# Altium project ee_453_Schulz.PrjPcb
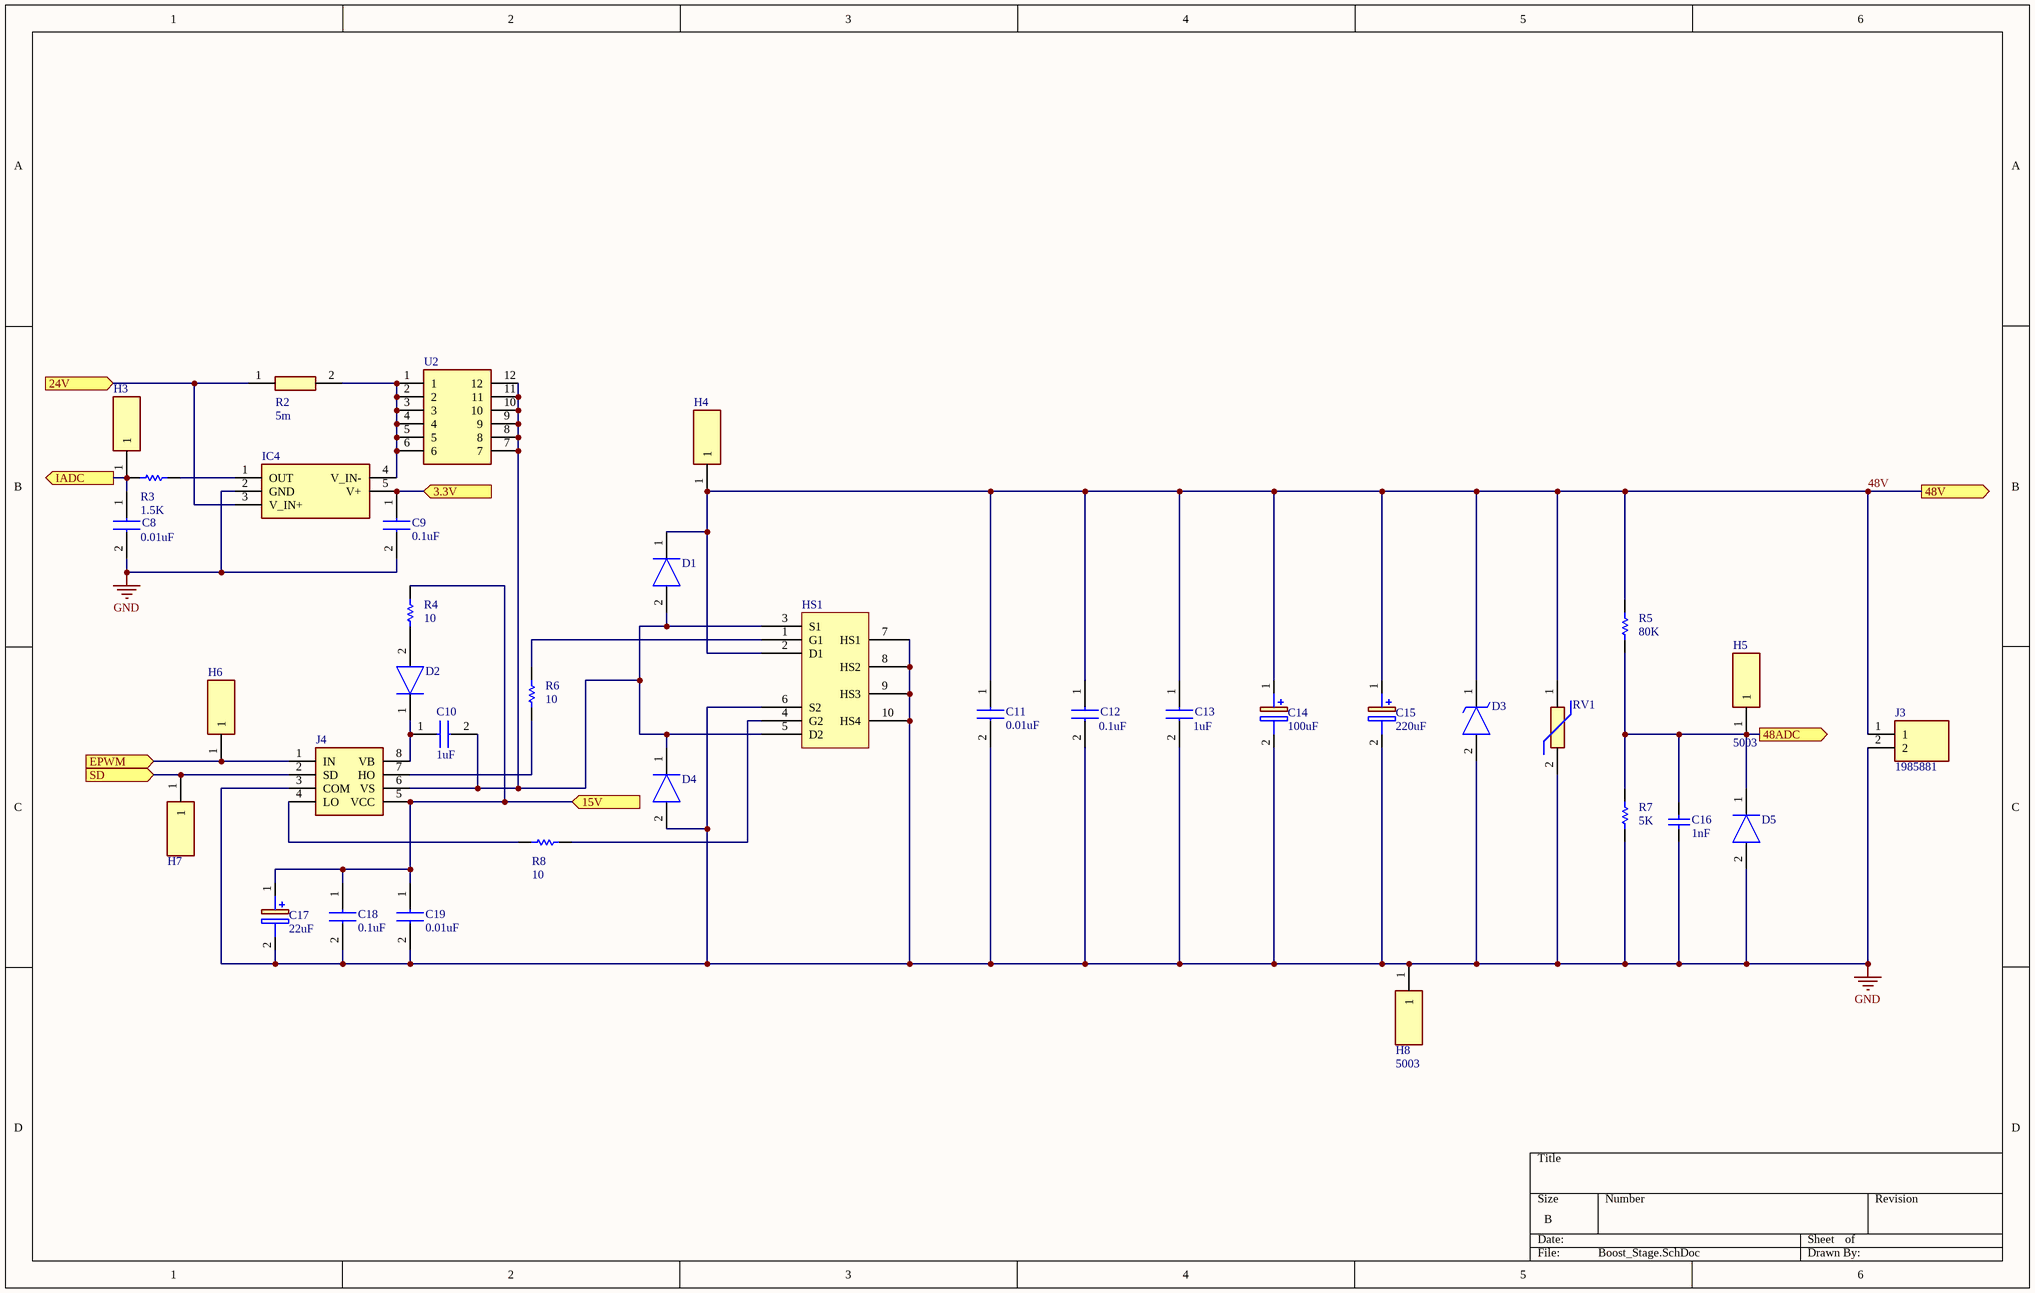
[diagram p0: Boost_Stage.SchDoc]
4 sheets, 112 parts. Net scope: flat (ports and power ports of the same name join across sheets).
Board file: ee453_pcb_Schulz.PcbDoc
Sheets:
  Boost_Stage.SchDoc
  ee453_pcb_Schulz.SchDoc
  Power_Stage.SchDoc
  Drive_Module.SchDoc

## Sheet Boost_Stage.SchDoc
size B

### Parts
C8  value 0.01uF  [C315C103K5R5TA7990]  (hidden comment: C315C103K5R5TA7990)
C9  value 0.1uF  [K104K10X7RF5UH5]  (hidden comment: K104K10X7RF5UH5)
C10  value 1uF  [RCE5C1H104J2A2H03B]  (hidden comment: RDER72A105K2M1H03A)
C11  value 0.01uF  [R82(7.2X2.5)]  (hidden comment: R82EC2100DQ50J)
C12  value 0.1uF  [ECQE2104JF]  (hidden comment: ECQ-E2104JF)
C13  value 1uF  [ECQE2105KF]  (hidden comment: ECQ-E2105KF)
C14  value 100uF  [CAPPRD500W65D1000H2200]  (hidden comment: EEU-FR2A101)
C15  value 220uF  [CAPPRD500W65D1250H2700]  (hidden comment: EEU-FS2A221)
C16  1nF  [CAPC2013X95X45NL10T25]
C17  value 22uF  [CAPPRD200W50D550H1250]  (hidden comment: UPW1E220MDD)
C18  value 0.1uF  [K104K10X7RF5UH5]  (hidden comment: K104K10X7RF5UH5)
C19  value 0.01uF  [C315C103K5R5TA7990]  (hidden comment: C315C103K5R5TA7990)
D1  S310FA  [SODFL3618X143N]  (value not drawn)
D2  1N4003  [DIOAD1413W86L463D238]  (value not drawn)
D3  P6KE91A-E3_54  [DIOAD1910W86L670D310]  (value not drawn)
D4  S310FA  [SODFL3618X143N]  (value not drawn)
D5  BZX584C3V3-G3-08  [SODFL1608X75N]  (value not drawn)
H3  5003  [5003]  (value not drawn)
H4  5003  [5003]  (value not drawn)
H5  5003  [5003]
H6  5003  [5003]  (value not drawn)
H7  5003  [5003]  (value not drawn)
H8  5003  [5003]
HS1  Dual Heatsink  [MOSFETsHeatsink]  (value not drawn)
IC4  INA194AIDBVR  [SOT95P280X145-5N]  (value not drawn)
J3  1985881  [SHDR2W110P0X500_1X2_1000X985X1390P]
J4  DILB8P-223TLF  [DIPS762W60P254L1016H525Q8N]  (value not drawn)
R2  5m  [CRE2512FZR005E3]
R3  value 1.5K  [AXIAL-0.3]  (hidden comment: Res1)
R4  value 10  [AXIAL-0.3]  (hidden comment: Res1)
R5  value 80K  [AXIAL-0.3]  (hidden comment: Res1)
R6  value 10  [AXIAL-0.3]  (hidden comment: Res1)
R7  value 5K  [AXIAL-0.3]  (hidden comment: Res1)
R8  value 10  [AXIAL-0.3]  (hidden comment: Res1)
RV1  V68ZS10P  [V68ZS10P]  (value not drawn)
U2  B65878E1012D001  [B65878E1012D001]  (value not drawn)

### Ports
3.3V (in), 15V (in), 24V (in), 48ADC (out), 48V (out), EPWM (in), IADC (out), SD (in)

### Nets
GND: C8.2 C9.2 C11.2 C12.2 C13.2 C14.2(-) C15.2(-) C16.1 C17.2(-) C18.2 C19.2 D3.2(A) D4.2(A) D5.2(A) H8.1 HS1.6(S2) HS1.7(HS1) HS1.8(HS2) HS1.9(HS3) HS1.10(HS4) IC4.2(GND) J3.2 J4.3(COM) R7.1 RV1.2
3.3V: C9.1 IC4.5(V+) ; port 3.3V
15V: C17.1(+) C18.1 C19.1 J4.5(VCC) R4.2 ; port 15V
24V: IC4.3(V_IN+) R2.1 ; port 24V
48ADC: C16.2 D5.1(K) H5.1 R5.1 R7.2 ; port 48ADC
48V: C11.1 C12.1 C13.1 C14.1(+) C15.1(+) D1.1(K) D3.1(K) H4.1 HS1.2(D1) J3.1 R5.2 RV1.1 ; port 48V
EPWM: H6.1 J4.1(IN) ; port EPWM
IADC: C8.1 H3.1 R3.2 ; port IADC
SD: H7.1 J4.2(SD) ; port SD
NetC10_1: C10.1 D2.1(K) J4.8(VB)
NetC10_2: C10.2 D1.2(A) D4.1(K) HS1.3(S1) HS1.5(D2) J4.6(VS) U2.7 U2.8 U2.9 U2.10 U2.11 U2.12
NetD2_2: D2.2(A) R4.1
NetHS1_1: HS1.1(G1) R6.2
NetHS1_4: HS1.4(G2) R8.1
NetIC4_1: IC4.1(OUT) R3.1
NetIC4_4: IC4.4(V_IN-) R2.2 U2.1 U2.2 U2.3 U2.4 U2.5 U2.6
NetJ4_4: J4.4(LO) R8.2
NetJ4_7: J4.7(HO) R6.1

### Library data of the parts
C8 C19 = C315C103K5R5TA7990: Capacitor 50V; Manufacturer_Name: Kemet; Datasheet Link: https://api.kemet.com/component-edge/download/datasheet/C315C103K5R5TA.pdf; Height: 4.66mm; Manufacturer_Part_Number: C315C103K5R5TA7990; Mouser Part Number: N/A; Mouser Price/Stock: https://www.mouser.com/Search/Refine.aspx?Keyword=N%2FA
C9 C18 = K104K10X7RF5UH5: Capacitor 50V; Manufacturer_Name: Vishay; Datasheet Link: https://www.vishay.com/docs/45171/kseries.pdf; Height: 6.2mm; Manufacturer_Part_Number: K104K10X7RF5UH5; Mouser Part Number: 594-K104K10X7RF5UH5; Mouser Price/Stock: https://www.mouser.com/Search/Refine.aspx?Keyword=594-K104K10X7RF5UH5
C10 = RDER72A105K2M1H03A: Capacitor; Manufacturer_Name: Murata Electronics; Datasheet Link: https://psearch.en.murata.com/capacitor/product/RDER72A105K2M1H03A.html; Height: 5.5mm; Manufacturer_Part_Number: RDER72A105K2M1H03A; Mouser Part Number: 81-RDER72A105K2M1H3A; Mouser Price/Stock: https://www.mouser.com/Search/Refine.aspx?Keyword=81-RDER72A105K2M1H3A; RS Part Number: 1504005; RS Price/Stock: http://uk.rs-online.com/web/p/products/1504005
C11 = R82EC2100DQ50J: Capacitor 100V; Manufacturer_Name: Kemet; Allied_Number: 70037796; Datasheet Link: http://docs-emea.rs-online.com/webdocs/1529/0900766b81529050.pdf; Manufacturer_Part_Number: R82EC2100DQ50J; Mouser Part Number: 80-R82EC2100DQ50J; Mouser Price/Stock: https://www.mouser.com/Search/Refine.aspx?Keyword=80-R82EC2100DQ50J; RS Part Number: 3121431P; RS Price/Stock: http://uk.rs-online.com/web/p/products/3121431P; Allied Price/Stock: https://www.alliedelec.com/kemet-r82ec2100dq50j/70037796/
C12 = ECQ-E2104JF: Capacitor 250V; Manufacturer_Name: Panasonic; Allied_Number: 70260012; Datasheet Link: http://industrial.panasonic.com/www-cgi/jvcr13pz.cgi?E+PZ+4+ABD0023+ECQE2104JF+8+WW; Height: 13.4mm; Manufacturer_Part_Number: ECQ-E2104JF; Mouser Part Number: 667-ECQ-E2104JF; Mouser Price/Stock: https://www.mouser.com/Search/Refine.aspx?Keyword=667-ECQ-E2104JF; Allied Price/Stock: https://www.alliedelec.com/panasonic-ecq-e2104jf/70260012/
C13 = ECQ-E2105KF: Capacitor 250V; Manufacturer_Name: Panasonic; Datasheet Link: https://industrial.panasonic.com/cdbs/www-data/pdf/RDI0000/ABD0000C179.pdf; Height: 15mm; Manufacturer_Part_Number: ECQ-E2105KF; Mouser Part Number: 667-ECQ-E2105KF; Mouser Price/Stock: https://www.mouser.com/Search/Refine.aspx?Keyword=667-ECQ-E2105KF
C14 = EEU-FR2A101: Capacitor Polarised 100V; Manufacturer_Name: Panasonic; Datasheet Link: https://industrial.panasonic.com/cdbs/www-data/pdf/RDF0000/ABA0000C1259.pdf; Height: 22mm; Manufacturer_Part_Number: EEU-FR2A101; Mouser Part Number: 667-EEU-FR2A101; Mouser Price/Stock: https://www.mouser.com/Search/Refine.aspx?Keyword=667-EEU-FR2A101
C15 = EEU-FS2A221: Capacitor Polarised 100V; Manufacturer_Name: Panasonic; Datasheet Link: https://industrial.panasonic.com/cdbs/www-data/pdf/RDF0000/ABA0000C1255.pdf; Height: 27mm; Manufacturer_Part_Number: EEU-FS2A221; Mouser Part Number: 667-EEU-FS2A221; Mouser Price/Stock: https://www.mouser.com/Search/Refine.aspx?Keyword=667-EEU-FS2A221
C16 = CMP-2007-00148-1: Part Number: GRM2195C2A102JA01D; Manufacturer: Murata
C17 = UPW1E220MDD: Capacitor Polarised  25V; Manufacturer_Name: Nichicon; Allied_Number: 70187288; Datasheet Link: http://nichicon-us.com/english/products/pdfs/e-upw.pdf; Height: 12.5mm; Manufacturer_Part_Number: UPW1E220MDD; Mouser Part Number: 647-UPW1E220MDD; Mouser Price/Stock: https://www.mouser.com/Search/Refine.aspx?Keyword=647-UPW1E220MDD; RS Part Number: 7152625P; RS Price/Stock: http://uk.rs-online.com/web/p/products/7152625P; Allied Price/Stock: https://www.alliedelec.com/nichicon-upw1e220mdd/70187288/
D1 D4 = S310FA: Diode; Manufacturer_Name: ON Semiconductor; Datasheet Link: https://eagle.componentsearchengine.com/Datasheets/2/S310FA.pdf; Height: 1.43mm; Manufacturer_Part_Number: S310FA; Mouser Part Number: 512-S310FA; Mouser Price/Stock: https://www.mouser.com/Search/Refine.aspx?Keyword=512-S310FA; RS Part Number: 1841470; RS Price/Stock: http://uk.rs-online.com/web/p/products/1841470
D2 = 1N4003: Diode; Manufacturer_Name: ON Semiconductor; Datasheet Link: http://docs-emea.rs-online.com/webdocs/10c0/0900766b810c07cd.pdf; Manufacturer_Part_Number: 1N4003; Mouser Part Number: 512-1N4003; Mouser Price/Stock: http://www.mouser.com/Search/ProductDetail.aspx?qs=PKwgOmPR8%252bn6tj%252bW%252bQZQFA%3d%3d; RS Part Number: 7596674P; RS Price/Stock: http://uk.rs-online.com/web/p/products/7596674P
D3 = P6KE91A-E3_54: TVS Diode (Uni-directional); Manufacturer_Name: Vishay; Manufacturer_Part_Number: P6KE91A-E3/54; Datasheet Link: https://www.mouser.com/datasheet/2/427/p6ke-1767850.pdf
D5 = BZX584C3V3-G3-08: Diode; Manufacturer_Name: Vishay; Datasheet Link: https://componentsearchengine.com/Datasheets/1/BZX584C3V3-G3-08.pdf; Height: 0.75mm; Manufacturer_Part_Number: BZX584C3V3-G3-08; Mouser Part Number: 78-BZX584C3V3-G3-08; Mouser Price/Stock: https://www.mouser.com/Search/Refine.aspx?Keyword=78-BZX584C3V3-G3-08
H3-H8 = 5003: Hardware; Manufacturer_Name: Keystone Electronics; Allied_Number: 70799414; Datasheet Link: https://componentsearchengine.com/Datasheets/1/5003.pdf; Height: 4.57mm; Manufacturer_Part_Number: 5003; Mouser Part Number: 534-5003; Mouser Price/Stock: https://www.mouser.com/Search/Refine.aspx?Keyword=534-5003; Allied Price/Stock: https://www.alliedelec.com/keystoneelectronics-5003/70799414/
HS1 = WV-DT2-101E_1: Heat Sink TO-220, TO-247 (Dual) Aluminum 4.0W @ 40°C Board Level, Vertical
IC4 = INA194AIDBVR: Integrated Circuit; Manufacturer_Name: Texas Instruments; Datasheet Link: http://www.ti.com/lit/gpn/ina194; Height: 1.45mm; Manufacturer_Part_Number: INA194AIDBVR; Mouser Part Number: 595-INA194AIDBVR; Mouser Price/Stock: https://www.mouser.com/Search/Refine.aspx?Keyword=595-INA194AIDBVR
J3 = 1985881: Connector; Manufacturer_Name: Phoenix Contact; Allied_Number: 70353630; Datasheet Link: https://www.phoenixcontact.com/online/portal/us?uri=pxc-oc-itemdetail:pid=1985881&library=usen&tab=1; Height: 13.9mm; Manufacturer_Part_Number: 1985881; Mouser Part Number: 651-1985881; Mouser Price/Stock: https://www.mouser.com/Search/Refine.aspx?Keyword=651-1985881; RS Part Number: 4670338; RS Price/Stock: http://uk.rs-online.com/web/p/products/4670338; Allied Price/Stock: https://www.alliedelec.com/phoenixcontact-1985881/70353630/
J4 = DILB8P-223TLF: Connector; Manufacturer_Name: Amphenol; Datasheet Link: https://componentsearchengine.com/Datasheets/1/DILB8P-223TLF.pdf; Height: 5.25mm; Mouser2 Part Number: 649-DILB8P223TLF; Mouser2 Price/Stock: https://www.mouser.com/Search/Refine.aspx?Keyword=649-DILB8P223TLF; Manufacturer_Part_Number: DILB8P-223TLF
R2 = CRE2512-FZ-R005E-3: 5mOhm Sensing Resistor CRE2512-FZ-R005E-3; Manufacturer_Name: Bourns; Allied_Number: 70418758; Datasheet Link: https://www.mouser.com/datasheet/2/54/re-1388683.pdf; Height: 0.7mm; Manufacturer_Part_Number: CRE2512-FZ-R005E-3; Mouser Part Number: 652-CRE2512FZR005E-3; Mouser Price/Stock: https://www.mouser.com/Search/Refine.aspx?Keyword=652-CRE2512FZR005E-3; RS Part Number: 1825562P; RS Price/Stock: http://uk.rs-online.com/web/p/products/1825562P; Allied Price/Stock: https://www.alliedelec.com/bourns-cre2512-fz-r005e-3/70418758/
R3-R8 = Res1: Resistor; Published: 8-Jun-2000; LatestRevisionDate: 17-Jul-2002; LatestRevisionNote: Re-released for DXP Platform.; PackageReference: AXIAL-0.3; Publisher: Altium Limited; PackageDescription: Axial Device, Thru-Hole; 2 Leads; 0.3 in Pin Spacing
RV1 = V68ZS10P: Varistor; Manufacturer_Name: LITTELFUSE; Datasheet Link: http://www.littelfuse.com/~/media/electronics/datasheets/varistors/littelfuse_varistor_za_datasheet.pdf.pdf; Height: 20mm; Manufacturer_Part_Number: V68ZS10P
U2 = B65878E1012D001: Undefined or Miscellaneous; Manufacturer_Name: EPCOS; Datasheet Link: http://www.mouser.com/datasheet/2/400/pq_26_25-1280911.pdf; Height: 29.3mm; Manufacturer_Part_Number: B65878E1012D001; Mouser Part Number: 871-B65878E1012D001; Mouser Price/Stock: https://www.mouser.com/Search/Refine.aspx?Keyword=871-B65878E1012D001; RS Part Number: 1253423; RS Price/Stock: http://uk.rs-online.com/web/p/products/1253423

## Sheet ee453_pcb_Schulz.SchDoc: EE 453 Capstone
size B; ApprovedBy: Your Name; CheckedBy: Your Name; Author: Your Name; CompanyName: Dept. of Elec. and Comp. Engg.; DrawnBy: Your Name; Engineer: Your Nmae; Organization: UW-Seattle; Address1: 185 Stevens Way; Address2: Paul Allen Center; Address3: Seattle, WA; Address4: US-98195; DocumentNumber: 1; Revision: 1.0; SheetNumber: 1; SheetTotal: 1
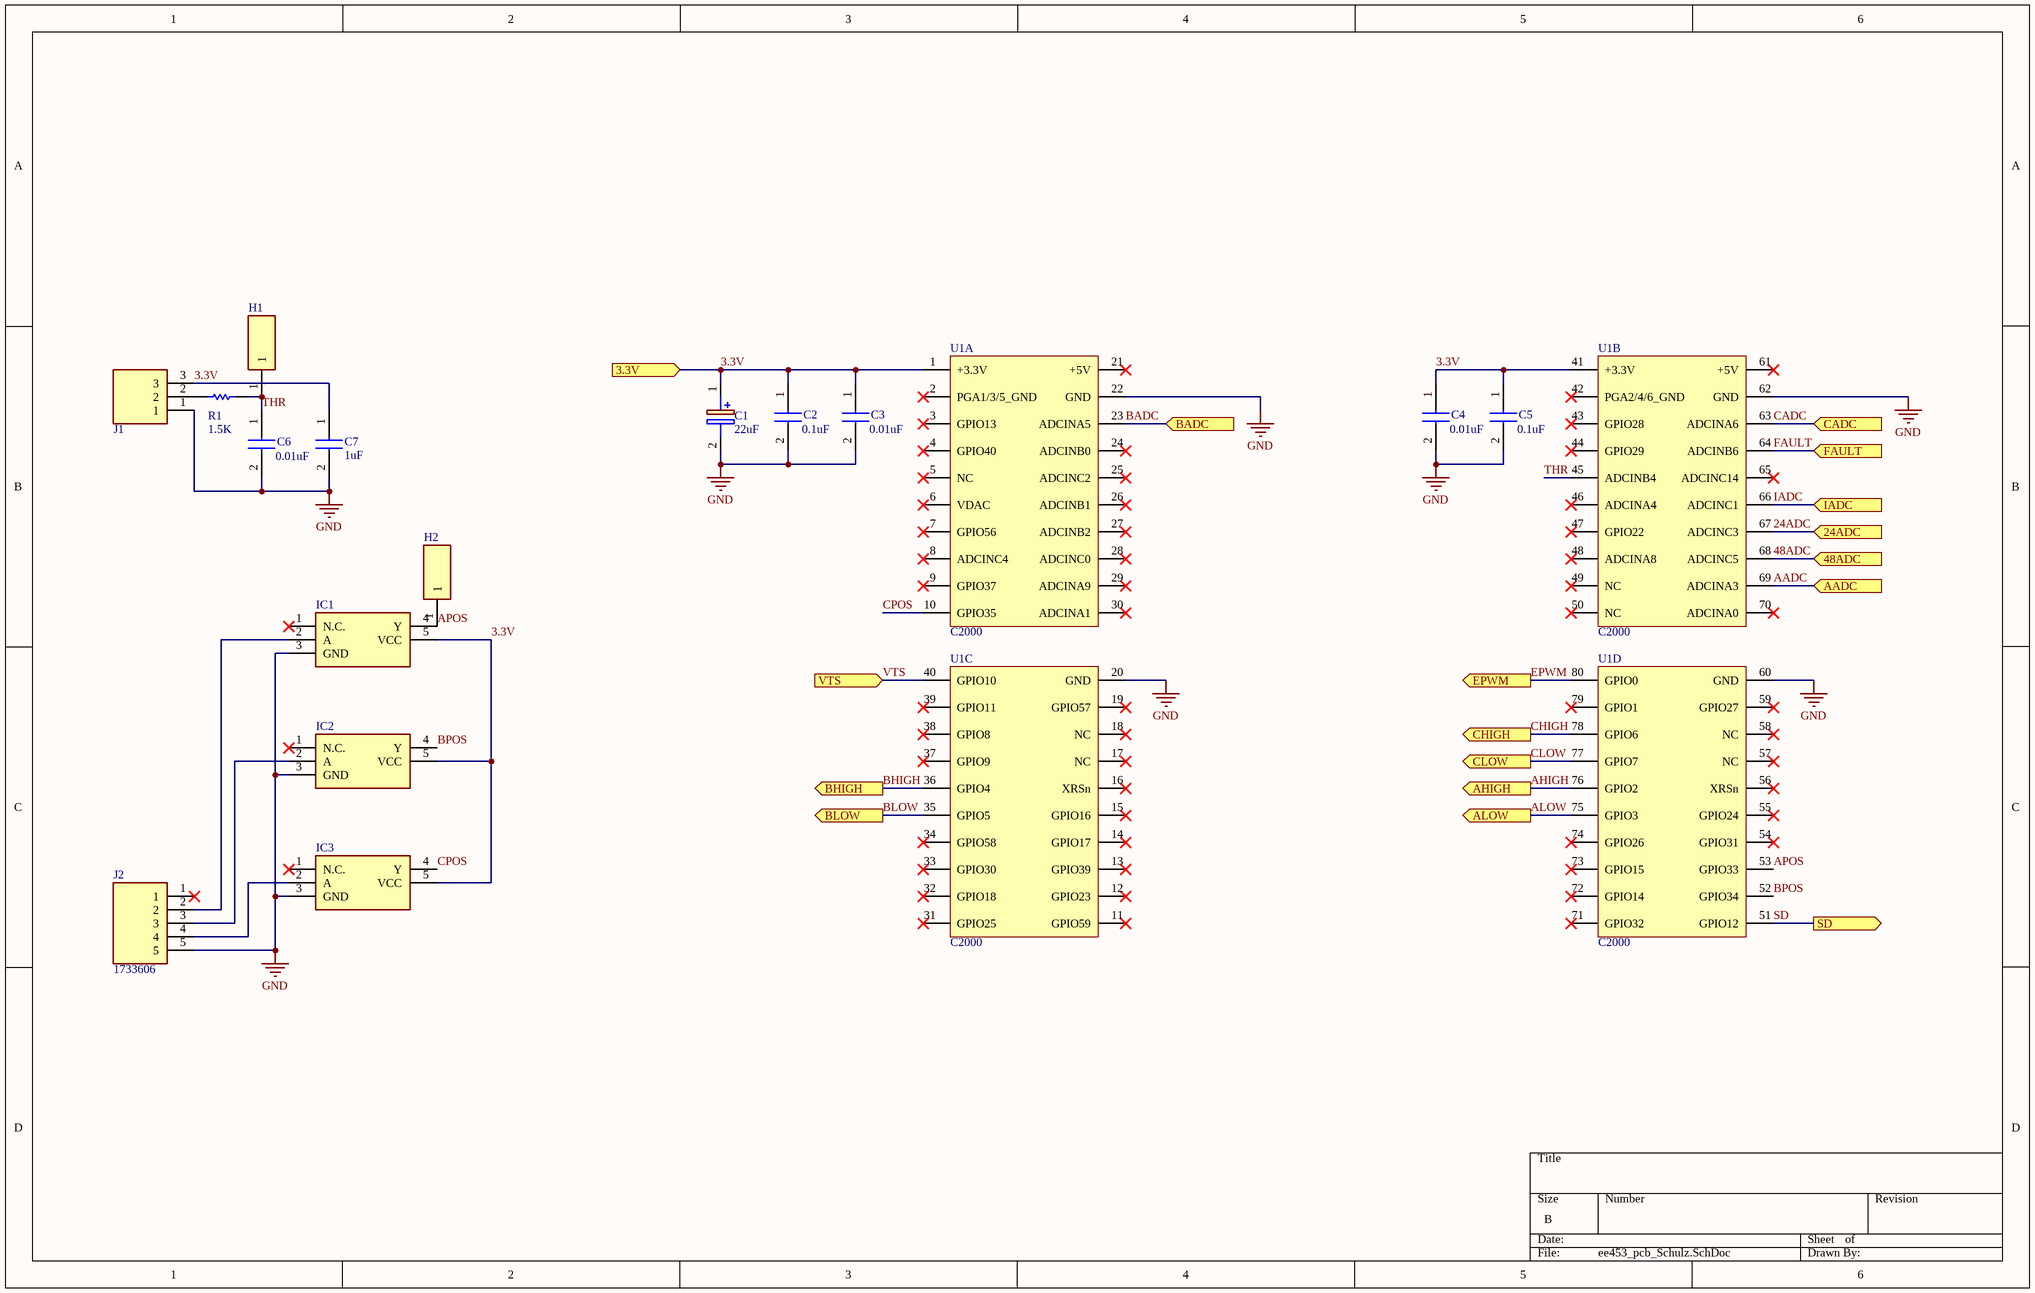
[diagram p1: ee453_pcb_Schulz.SchDoc]

### Parts
C1  value 22uF  [CAPPRD250W50D800H800]  (hidden comment: ECE-A1AKA220I)
C2  value 0.1uF  [CAPC1005X55N]  (hidden comment: CC0402KRX7R6BB104)
C3  value 0.01uF  [CAPC0603X33N]  (hidden comment: GRM033R71A103KA01D)
C4  value 0.01uF  [CAPC0603X33N]  (hidden comment: GRM033R71A103KA01D)
C5  value 0.1uF  [CAPC1005X55N]  (hidden comment: CC0402KRX7R6BB104)
C6  value 0.01uF  [C315C103K5R5TA7990]  (hidden comment: C315C103K5R5TA7990)
C7  value 1uF  [C330C105K5R5TA]  (hidden comment: C330C105K5R5TA)
H1  5003  [5003]  (value not drawn)
H2  5003  [5003]  (value not drawn)
IC1  SN74LV1T34DBVRG4  [SOT95P280X145-5N]  (value not drawn)
IC2  SN74LV1T34DBVRG4  [SOT95P280X145-5N]  (value not drawn)
IC3  SN74LV1T34DBVRG4  [SOT95P280X145-5N]  (value not drawn)
J1  1985917  [1985917]  (value not drawn)
J2  1733606  [SHDR5W110P0X500_1X5_2532X7360X1530P]
R1  value 1.5K  [AXIAL-0.3]  (hidden comment: Res1)
U1  C2000  [C2000]  (parts A,B,C,D of 4)

### Ports
3.3V (in), 24ADC (in), 48ADC (in), AADC (in), AHIGH (out), ALOW (out), BADC (in), BHIGH (out), BLOW (out), CADC (in), CHIGH (out), CLOW (out), EPWM (out), FAULT (in), IADC (in), SD (out), VTS (in)

### Nets
GND: C1.2(-) C2.2 C3.2 C4.2 C5.2 C6.2 C7.2 IC1.3(GND) IC2.3(GND) IC3.3(GND) J1.1 J2.5 U1.20(GND) U1.22(GND) U1.60(GND) U1.62(GND)
3.3V: C1.1(+) C2.1 C3.1 C4.1 C5.1 C7.1 IC1.5(VCC) IC2.5(VCC) IC3.5(VCC) J1.3 U1.1(+3.3V) U1.41(+3.3V) ; port 3.3V
24ADC: U1.67(ADCINC3) ; port 24ADC
48ADC: U1.68(ADCINC5) ; port 48ADC
AADC: U1.69(ADCINA3) ; port AADC
AHIGH: U1.76(GPIO2) ; port AHIGH
ALOW: U1.75(GPIO3) ; port ALOW
APOS: H2.1 IC1.4(Y) U1.53(GPIO33)
BADC: U1.23(ADCINA5) ; port BADC
BHIGH: U1.36(GPIO4) ; port BHIGH
BLOW: U1.35(GPIO5) ; port BLOW
BPOS: IC2.4(Y) U1.52(GPIO34)
CADC: U1.63(ADCINA6) ; port CADC
CHIGH: U1.78(GPIO6) ; port CHIGH
CLOW: U1.77(GPIO7) ; port CLOW
CPOS: IC3.4(Y) U1.10(GPIO35)
EPWM: U1.80(GPIO0) ; port EPWM
FAULT: U1.64(ADCINB6) ; port FAULT
IADC: U1.66(ADCINC1) ; port IADC
SD: U1.51(GPIO12) ; port SD
THR: C6.1 H1.1 R1.1 U1.45(ADCINB4)
VTS: U1.40(GPIO10) ; port VTS
NetIC1_2: IC1.2(A) J2.2
NetIC2_2: IC2.2(A) J2.3
NetIC3_2: IC3.2(A) J2.4
NetJ1_2: J1.2 R1.2

Not connected (* = marked no-connect by the designer): IC1 1(N.C.)*; IC2 1(N.C.)*; IC3 1(N.C.)*; J2 1*; U1 2(PGA1/3/5_GND)* 3(GPIO13)* 4(GPIO40)* 5(NC)* 6(VDAC)* 7(GPIO56)* 8(ADCINC4)* 9(GPIO37)* 11(GPIO59)* 12(GPIO23)* 13(GPIO39)* 14(GPIO17)* 15(GPIO16)* 16(XRSn)* 17(NC)* 18(NC)* 19(GPIO57)* 21(+5V)* 24(ADCINB0)* 25(ADCINC2)* 26(ADCINB1)* 27(ADCINB2)* 28(ADCINC0)* 29(ADCINA9)* 30(ADCINA1)* 31(GPIO25)* 32(GPIO18)* 33(GPIO30)* 34(GPIO58)* 37(GPIO9)* 38(GPIO8)* 39(GPIO11)* 42(PGA2/4/6_GND)* 43(GPIO28)* 44(GPIO29)* 46(ADCINA4)* 47(GPIO22)* 48(ADCINA8)* 49(NC)* 50(NC)* 54(GPIO31)* 55(GPIO24)* 56(XRSn)* 57(NC)* 58(NC)* 59(GPIO27)* 61(+5V)* 65(ADCINC14)* 70(ADCINA0)* 71(GPIO32)* 72(GPIO14)* 73(GPIO15)* 74(GPIO26)* 79(GPIO1)*

### Notes on the sheet
- Title
- Size:
- Date:
- B
- Number:
- Time:
- Revision:
- Sheet
- of
- File:

### Library data of the parts
C1 = ECE-A1AKA220I: Capacitor Polarised 10V; Manufacturer_Name: Panasonic; Datasheet Link: https://componentsearchengine.com/Datasheets/1/ECE-A1AKA220I.pdf; Height: 8mm; Manufacturer_Part_Number: ECE-A1AKA220I; Mouser Part Number: 667-ECE-A1AKA220I; Mouser Price/Stock: https://www.mouser.com/Search/Refine.aspx?Keyword=667-ECE-A1AKA220I
C2 C5 = CC0402KRX7R6BB104: Capacitor 10V; Manufacturer_Name: YAGEO (PHYCOMP); Datasheet Link: https://www.mouser.com/datasheet/2/447/UPY-GPHC_X7R_6.3V-to-50V_18-1154002.pdf; Height: 0.55mm; Manufacturer_Part_Number: CC0402KRX7R6BB104; Mouser Part Number: 603-CC402KRX7R6BB104; Mouser Price/Stock: https://www.mouser.com/Search/Refine.aspx?Keyword=603-CC402KRX7R6BB104; RS Part Number: 6698690; RS Price/Stock: http://uk.rs-online.com/web/p/products/6698690
C3 C4 = GRM033R71A103KA01D: Capacitor 10V; Manufacturer_Name: Murata Electronics; Datasheet Link: https://psearch.en.murata.com/capacitor/product/GRM033R71A103KA01%23.html; Height: 0.33mm; Manufacturer_Part_Number: GRM033R71A103KA01D; Mouser Part Number: 81-GRM033R71A103KA1D; Mouser Price/Stock: https://www.mouser.com/Search/Refine.aspx?Keyword=81-GRM033R71A103KA1D; RS Part Number: 7235143P; RS Price/Stock: http://uk.rs-online.com/web/p/products/7235143P
C6 = C315C103K5R5TA7990: Capacitor 50V; Manufacturer_Name: Kemet; Datasheet Link: https://api.kemet.com/component-edge/download/datasheet/C315C103K5R5TA.pdf; Height: 4.66mm; Manufacturer_Part_Number: C315C103K5R5TA7990; Mouser Part Number: N/A; Mouser Price/Stock: https://www.mouser.com/Search/Refine.aspx?Keyword=N%2FA
C7 = C330C105K5R5TA: Capacitor 50V; Manufacturer_Name: Kemet; Datasheet Link: http://uk.rs-online.com/web/p/products/8704038; Height: 9mm; Manufacturer_Part_Number: C330C105K5R5TA; Mouser Part Number: 80-C330C105K5R; Mouser Price/Stock: https://www.mouser.com/Search/Refine.aspx?Keyword=80-C330C105K5R; RS Part Number: 8704038; RS Price/Stock: http://uk.rs-online.com/web/p/products/8704038
H1 H2 = 5003: as H3 on sheet Boost_Stage; Datasheet Link: https://componentsearchengine.com/Datasheets/1/5003.pdf; Height: 4.57mm; Manufacturer_Part_Number: 5003; Mouser Part Number: 534-5003; Mouser Price/Stock: https://www.mouser.com/Search/Refine.aspx?Keyword=534-5003; Allied Price/Stock: https://www.alliedelec.com/keystoneelectronics-5003/70799414/
IC1-IC3 = SN74LV1T34DBVRG4: Integrated Circuit; Manufacturer_Name: Texas Instruments; Datasheet Link: http://www.ti.com/lit/gpn/sn74lv1t34; Height: 1.45mm; Manufacturer_Part_Number: SN74LV1T34DBVRG4; Mouser Part Number: 595-SN74LV1T34DBVRG4; Mouser Price/Stock: https://www.mouser.com/Search/Refine.aspx?Keyword=595-SN74LV1T34DBVRG4
J1 = 1985917: Connector; Manufacturer_Name: Phoenix Contact; Allied_Number: 70353658; Datasheet Link: https://media.digikey.com/pdf/Data%20Sheets/Phoenix%20Contact%20PDFs/Multi-Postion%20PCTerminal%20Blocks.pdf; Height: 13.95mm; Manufacturer_Part_Number: 1985917; Mouser Part Number: 651-1985917; Mouser Price/Stock: https://www.mouser.com/Search/Refine.aspx?Keyword=651-1985917; RS Part Number: 8552938; RS Price/Stock: http://uk.rs-online.com/web/p/products/8552938; Allied Price/Stock: https://www.alliedelec.com/phoenixcontact-1985917/70353658/
J2 = 1733606: Connector; Manufacturer_Name: Phoenix Contact; Datasheet Link: https://www.phoenixcontact.com/online/portal/gb/?uri=pxc-oc-itemdetail:pid=1733606&library=gben&pcck=P-11-01-05&tab=1&selectedCategory=ALL; Height: 15.3mm; Manufacturer_Part_Number: 1733606; Mouser Part Number: 651-1733606; Mouser Price/Stock: https://www.mouser.com/Search/Refine.aspx?Keyword=651-1733606; RS Part Number: 8818799; RS Price/Stock: https://uk.rs-online.com/web/p/products/8818799
R1 = Res1: Resistor; Published: 8-Jun-2000; LatestRevisionDate: 17-Jul-2002; LatestRevisionNote: Re-released for DXP Platform.; PackageReference: AXIAL-0.3; Publisher: Altium Limited; PackageDescription: Axial Device, Thru-Hole; 2 Leads; 0.3 in Pin Spacing
U1 = C2000: F280049C; Parameter 1: test 2

## Sheet Power_Stage.SchDoc
size B
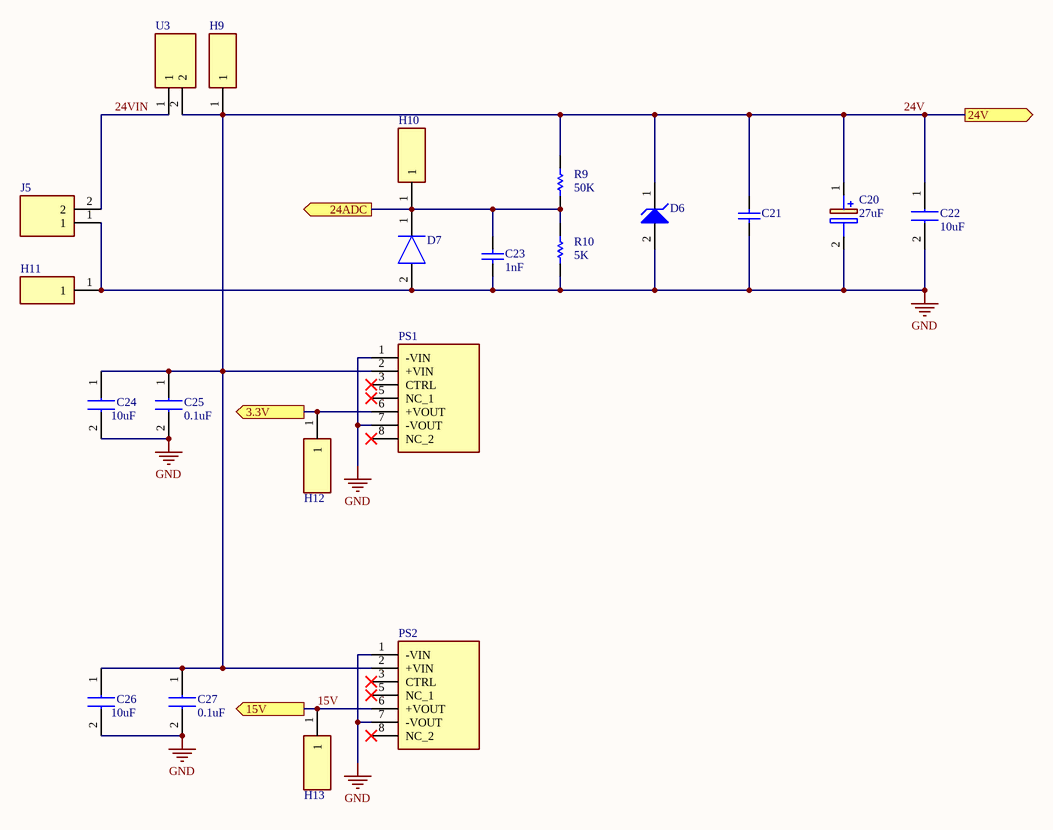
[diagram p2: Power_Stage.SchDoc]

### Parts
C20  27uF  [CAPPRD200W55D500H1250]
C21  VC060326A580RP  [CAPC1608X90X35ML15T15]  (value not drawn)
C22  10uF  [MKS4B051004J00KSSD]
C23  1nF  [CAPC2013X95X45NL10T25]
C24  value 10uF  [MKS4B051004J00KSSD]  (hidden comment: MKS4B051004J00KSSD)
C25  value 0.1uF  [K104K10X7RF5UH5]  (hidden comment: K104K10X7RF5UH5)
C26  value 10uF  [MKS4B051004J00KSSD]  (hidden comment: MKS4B051004J00KSSD)
C27  value 0.1uF  [K104K10X7RF5UH5]  (hidden comment: K104K10X7RF5UH5)
D6  P6KE47A  [ONSC-SURMETIC40-2-017AA-01]  (value not drawn)
D7  BZX584C3V3-G3-08  [SODFL1608X75N]  (value not drawn)
H9  5003  [5003]  (value not drawn)
H10  5003  [5003]  (value not drawn)
H11  5003  [5003]  (value not drawn)
H12  5003  [5003]  (value not drawn)
H13  5003  [5003]  (value not drawn)
J5  1985881  [SHDR2W110P0X500_1X2_1000X985X1390P]  (value not drawn)
PS1  RS3-243.3S  [RS32433S]  (value not drawn)
PS2  RS3-2415S  [RS32415S]  (value not drawn)
R9  value 50K  [AXIAL-0.3]  (hidden comment: Res1)
R10  value 5K  [AXIAL-0.3]  (hidden comment: Res1)
U3  0PTF0078P  [0PTF0078P]  (value not drawn)

### Ports
3.3V (out), 15V (out), 24ADC (out), 24V (out)

### Nets
GND: C20.2(-) C21.1 C22.2 C23.1 C24.2 C25.2 C26.2 C27.2 D6.2(A) D7.2(A) H11.1 J5.1 PS1.1(-VIN) PS1.7(-VOUT) PS2.1(-VIN) PS2.7(-VOUT) R10.1
3.3V: H12.1 PS1.6(+VOUT) ; port 3.3V
15V: H13.1 PS2.6(+VOUT) ; port 15V
24ADC: C23.2 D7.1(K) H10.1 R9.1 R10.2 ; port 24ADC
24V: C20.1(+) C21.2 C22.1 C24.1 C25.1 C26.1 C27.1 D6.1(K) H9.1 PS1.2(+VIN) PS2.2(+VIN) R9.2 U3.2 ; port 24V
24VIN: J5.2 U3.1

Not connected (* = marked no-connect by the designer): PS1 3(CTRL)* 5(NC_1)* 8(NC_2)*; PS2 3(CTRL)* 5(NC_1)* 8(NC_2)*

### Library data of the parts
C20 = EEU-FS1H270B: 50V 27uF electrolytic cap EEU-FS1H270B; Manufacturer_Name: Panasonic; Datasheet Link: https://componentsearchengine.com/Datasheets/1/EEU-FS1H270B.pdf; Height: 12.5mm; Manufacturer_Part_Number: EEU-FS1H270B; Mouser Part Number: 667-EEU-FS1H270B; Mouser Price/Stock: https://www.mouser.com/Search/Refine.aspx?Keyword=667-EEU-FS1H270B
C21 = CMP-2006-02022-1: Manufacturer: AVX Interconnect / Elco; Part Number: VC060326A580RP
C22 = MKS4B051004J00KSSD: Manufacturer_Name: WIMA; Datasheet Link: https://www.mouser.com/datasheet/2/440/e_WIMA_MKS_4-1139797.pdf; Height: 16mm; Manufacturer_Part_Number: MKS4B051004J00KSSD; Mouser Part Number: 505-MKS410/50/10; Mouser Price/Stock: https://www.mouser.com/Search/Refine.aspx?Keyword=505-MKS410%2F50%2F10
C23 = CMP-2007-00148-1: as C16 on sheet Boost_Stage
C24 C26 = MKS4B051004J00KSSD: Capacitor 50V; Manufacturer_Name: WIMA; Datasheet Link: https://www.mouser.com/datasheet/2/440/e_WIMA_MKS_4-1139797.pdf; Height: 16mm; Manufacturer_Part_Number: MKS4B051004J00KSSD; Mouser Part Number: 505-MKS410/50/10; Mouser Price/Stock: https://www.mouser.com/Search/Refine.aspx?Keyword=505-MKS410%2F50%2F10
C25 C27 = K104K10X7RF5UH5: Capacitor 50V; Manufacturer_Name: Vishay; Datasheet Link: https://www.vishay.com/docs/45171/kseries.pdf; Height: 6.2mm; Manufacturer_Part_Number: K104K10X7RF5UH5; Mouser Part Number: 594-K104K10X7RF5UH5; Mouser Price/Stock: https://www.mouser.com/Search/Refine.aspx?Keyword=594-K104K10X7RF5UH5
D6 = CMP-1061-00684-1: 600 W Peak Power Transient Voltage Suppressor, 2-Pin Surmetic(TM) 40, Pb-Free, Bulk Box. [40V TVS Diode (P6KE47A)]; PartNumber: P6KE47AG; Manufacturer: On Semiconductor; Direction: Unidirectional; PPK Max (W): 600; V(BR) Typ (V): 47.05; IR Max (uA): 5; PackageVersion: Rev. O, 09/2005; PackageDescription: 2-Pin, Axial Lead, Diameter 3.49 mm; Mounting Technology: Through Hole; ComponentLink1URL: http://www.onsemi.com/; Packing: Bulk Box; ComponentLink2Description: Datasheet; RoHS: Pb-Free; DatasheetVersion: Rev. 10; ComponentLink1Description: Manufacturer URL; ComponentLink3URL: http://www.onsemi.cn/pub_link/Collateral/017AA.PDF; ComponentLink3Description: Package Specification; ComponentLink2URL: http://www.onsemi.com/pub_link/Collateral/P6KE6.8A-D.PDF; PackageReference: SURMETIC40-2-017AA-01
D7 = BZX584C3V3-G3-08: Diode; Manufacturer_Name: Vishay; Datasheet Link: https://componentsearchengine.com/Datasheets/1/BZX584C3V3-G3-08.pdf; Height: 0.75mm; Manufacturer_Part_Number: BZX584C3V3-G3-08; Mouser Part Number: 78-BZX584C3V3-G3-08; Mouser Price/Stock: https://www.mouser.com/Search/Refine.aspx?Keyword=78-BZX584C3V3-G3-08
H9-H13 = 5003: as H3 on sheet Boost_Stage; Datasheet Link: https://componentsearchengine.com/Datasheets/1/5003.pdf; Height: 4.57mm; Manufacturer_Part_Number: 5003; Mouser Part Number: 534-5003; Mouser Price/Stock: https://www.mouser.com/Search/Refine.aspx?Keyword=534-5003; Allied Price/Stock: https://www.alliedelec.com/keystoneelectronics-5003/70799414/
J5 = 1985881: 2-Port Connector; Manufacturer_Name: Phoenix Contact; Allied_Number: 70353630; Datasheet Link: https://www.phoenixcontact.com/online/portal/us?uri=pxc-oc-itemdetail:pid=1985881&library=usen&tab=1; Height: 13.9mm; Manufacturer_Part_Number: 1985881; Mouser Part Number: 651-1985881; Mouser Price/Stock: https://www.mouser.com/Search/Refine.aspx?Keyword=651-1985881; RS Part Number: 4670338; RS Price/Stock: http://uk.rs-online.com/web/p/products/4670338; Allied Price/Stock: https://www.alliedelec.com/phoenixcontact-1985881/70353630/
PS1 = RS3-243.3S: Power Supply; Manufacturer_Name: RECOM Power; Datasheet Link: https://www.arrow.com/en/products/rs3-243.3s/recom-power; Height: 11.35mm; Manufacturer_Part_Number: RS3-243.3S; Mouser Part Number: 919-RS3-243.3S; Mouser Price/Stock: https://www.mouser.com/Search/Refine.aspx?Keyword=919-RS3-243.3S; RS Part Number: 0163748P; RS Price/Stock: http://uk.rs-online.com/web/p/products/0163748P
PS2 = RS3-2415S: Power Supply; Manufacturer_Name: RECOM Power; Datasheet Link: https://www.recom-power.com/pdf/Econoline/RS3-S_D_Z.pdf; Height: 11.35mm; Manufacturer_Part_Number: RS3-2415S; Mouser Part Number: 919-RS3-2415S; Mouser Price/Stock: https://www.mouser.com/Search/Refine.aspx?Keyword=919-RS3-2415S
R9 R10 = Res1: Resistor; Published: 8-Jun-2000; LatestRevisionDate: 17-Jul-2002; LatestRevisionNote: Re-released for DXP Platform.; PackageReference: AXIAL-0.3; Publisher: Altium Limited; PackageDescription: Axial Device, Thru-Hole; 2 Leads; 0.3 in Pin Spacing
U3 = 0PTF0078P: Fuse holder; Manufacturer_Name: LITTELFUSE; Datasheet Link: https://media.digikey.com/pdf/Data%20Sheets/Littelfuse%20PDFs/PTF075_77_78.pdf; Height: 11.5mm; Manufacturer_Part_Number: 0PTF0078P; Mouser Part Number: 576-0PTF0078P; Mouser Price/Stock: https://www.mouser.com/Search/Refine.aspx?Keyword=576-0PTF0078P; RS Part Number: 1740656; RS Price/Stock: http://uk.rs-online.com/web/p/products/1740656

## Sheet Drive_Module.SchDoc
size B
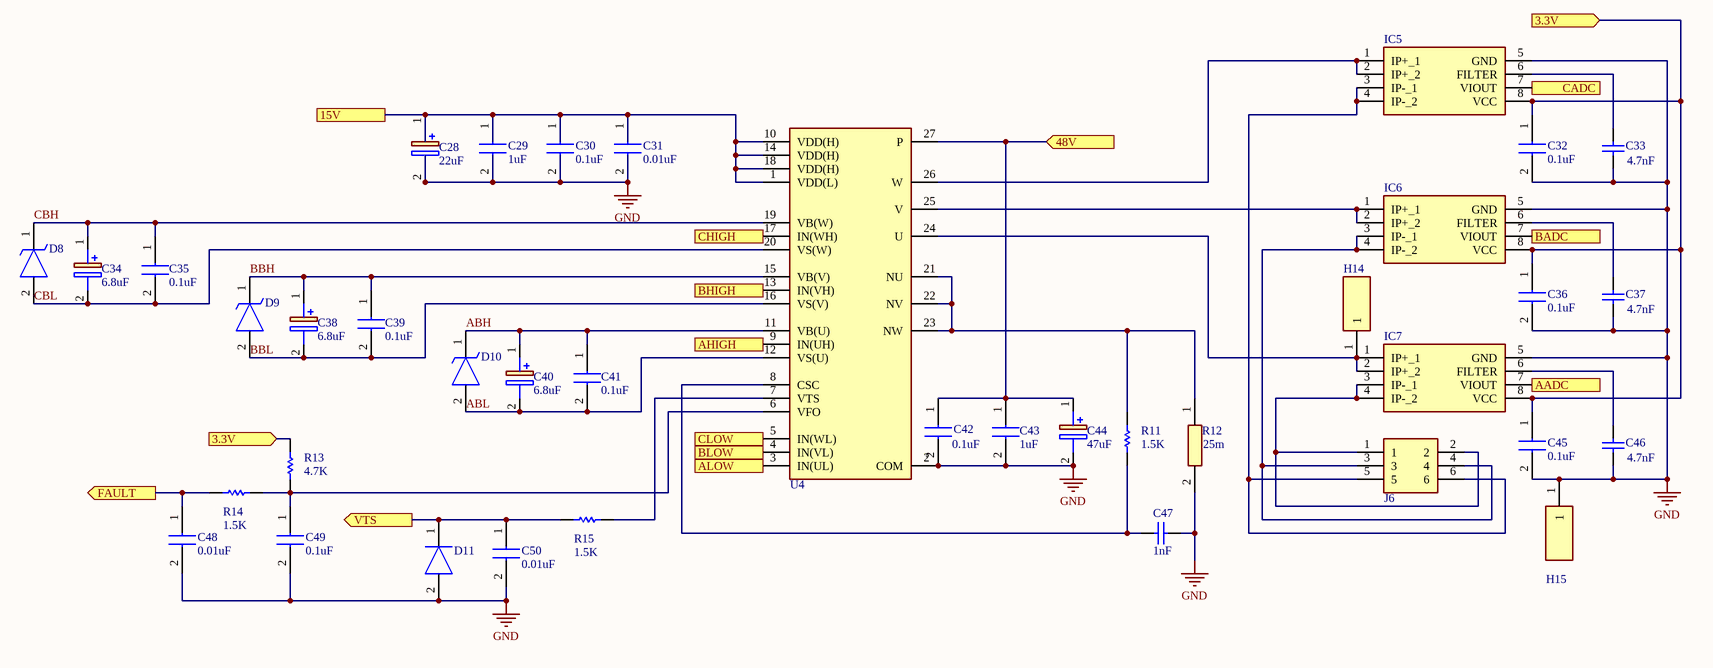
[diagram p3: Drive_Module.SchDoc]

### Parts
C28  value 22uF  [CAPPRD200W50D550H1250]  (hidden comment: UPW1E220MDD)
C29  value 1uF  [C330C105K5R5TA]  (hidden comment: C330C105K5R5TA)
C30  value 0.1uF  [K104K10X7RF5UH5]  (hidden comment: K104K10X7RF5UH5)
C31  value 0.01uF  [C315C103K5R5TA7990]  (hidden comment: C315C103K5R5TA7990)
C32  value 0.1uF  [CAPC1608X95N]  (hidden comment: C0603C104K5RAC3121)
C33  value 4.7nF  [CAPC1608X90X35ML10T15]  (hidden comment: GRM188R71H472KA01D)
C34  6.8uF  [CAPPRD150W45D425H1250]
C35  value 0.1uF  [K104K10X7RF5UH5]  (hidden comment: K104K10X7RF5UH5)
C36  value 0.1uF  [CAPC1608X95N]  (hidden comment: C0603C104K5RAC3121)
C37  value 4.7nF  [CAPC1608X90X35ML10T15]  (hidden comment: GRM188R71H472KA01D)
C38  6.8uF  [CAPPRD150W45D425H1250]
C39  value 0.1uF  [K104K10X7RF5UH5]  (hidden comment: K104K10X7RF5UH5)
C40  6.8uF  [CAPPRD150W45D425H1250]
C41  value 0.1uF  [K104K10X7RF5UH5]  (hidden comment: K104K10X7RF5UH5)
C42  value 0.1uF  [CAPC1608X90N]  (hidden comment: GRM188R72A104MA35D)
C43  value 1uF  [RCE5C1H104J2A2H03B]  (hidden comment: RDER72A105K2M1H03A)
C44  value 47uF  [CAPPRD350W65D800H1650]  (hidden comment: EEU-FS2A470)
C45  value 0.1uF  [CAPC1608X95N]  (hidden comment: C0603C104K5RAC3121)
C46  value 4.7nF  [CAPC1608X90X35ML10T15]  (hidden comment: GRM188R71H472KA01D)
C47  1nF  [CAPC2013X95X45NL10T25]
C48  value 0.01uF  [C315C103K5R5TA7990]  (hidden comment: C315C103K5R5TA7990)
C49  value 0.1uF  [K104K10X7RF5UH5]  (hidden comment: K104K10X7RF5UH5)
C50  value 0.01uF  [C315C103K5R5TA7990]  (hidden comment: C315C103K5R5TA7990)
D8  P6KE91A-E3_54  [DIOAD1910W86L670D310]  (value not drawn)
D9  P6KE91A-E3_54  [DIOAD1910W86L670D310]  (value not drawn)
D10  P6KE91A-E3_54  [DIOAD1910W86L670D310]  (value not drawn)
D11  BZX584C3V3-G3-08  [SODFL1608X75N]  (value not drawn)
H14  5003  [5003]  (value not drawn)
H15  5003  [5003]  (value not drawn)
IC5  ACS725LLCTR-20AB-T  [SOT127P600X175-8N]  (value not drawn)
IC6  ACS725LLCTR-20AB-T  [SOT127P600X175-8N]  (value not drawn)
IC7  ACS725LLCTR-20AB-T  [SOT127P600X175-8N]  (value not drawn)
J6  1730515  [1730515]  (value not drawn)
R11  value 1.5K  [AXIAL-0.3]  (hidden comment: Res1)
R12  value 25m  [RESC7146X175N]  (hidden comment: WSHP2818R0500FEA)
R13  value 4.7K  [AXIAL-0.3]  (hidden comment: Res1)
R14  value 1.5K  [AXIAL-0.3]  (hidden comment: Res1)
R15  value 1.5K  [AXIAL-0.3]  (hidden comment: Res1)
U4  FNB34060T  [FNB34060T]  (value not drawn)

### Ports
3.3V (in), 15V, 48V (in), AADC (out), AHIGH (in), ALOW (in), BADC (out), BHIGH (in), BLOW (in), CADC (out), CHIGH (in), CLOW (in), FAULT (out), VTS (out)

### Nets
GND: C28.2(-) C29.2 C30.2 C31.2 C32.2 C33.2 C36.2 C37.2 C42.2 C43.2 C44.2(-) C45.2 C46.2 C47.2 C48.2 C49.2 C50.2 D11.2(A) H15.1 IC5.5(GND) IC6.5(GND) IC7.5(GND) R12.2 U4.2(COM)
3.3V: C32.1 C36.1 C45.1 IC5.8(VCC) IC6.8(VCC) IC7.8(VCC) R13.2 ; port 3.3V
15V: C28.1(+) C29.1 C30.1 C31.1 U4.1(VDD(L)) U4.10(VDD(H)) U4.14(VDD(H)) U4.18(VDD(H)) ; port 15V
48V: C42.1 C43.1 C44.1(+) U4.27(P) ; port 48V
AADC: IC7.7(VIOUT) ; port AADC
ABH: C40.1(+) C41.1 D10.1(K) U4.11(VB(U))
ABL: C40.2(-) C41.2 D10.2(A) U4.12(VS(U))
AHIGH: U4.9(IN(UH)) ; port AHIGH
ALOW: U4.3(IN(UL)) ; port ALOW
BADC: IC6.7(VIOUT) ; port BADC
BBH: C38.1(+) C39.1 D9.1(K) U4.15(VB(V))
BBL: C38.2(-) C39.2 D9.2(A) U4.16(VS(V))
BHIGH: U4.13(IN(VH)) ; port BHIGH
BLOW: U4.4(IN(VL)) ; port BLOW
CADC: IC5.7(VIOUT) ; port CADC
CBH: C34.1(+) C35.1 D8.1(K) U4.19(VB(W))
CBL: C34.2(-) C35.2 D8.2(A) U4.20(VS(W))
CHIGH: U4.17(IN(WH)) ; port CHIGH
CLOW: U4.5(IN(WL)) ; port CLOW
FAULT: C48.1 R14.1 ; port FAULT
VTS: C50.1 D11.1(K) R15.2 ; port VTS
NetC33_1: C33.1 IC5.6(FILTER)
NetC37_1: C37.1 IC6.6(FILTER)
NetC46_1: C46.1 IC7.6(FILTER)
NetC47_1: C47.1 R11.1 U4.8(CSC)
NetC49_1: C49.1 R13.1 R14.2 U4.6(VFO)
NetH14_1: H14.1 IC7.1(IP+_1) IC7.2(IP+_2) U4.24(U)
NetIC5_1: IC5.1(IP+_1) IC5.2(IP+_2) U4.26(W)
NetIC5_3: IC5.3(IP-_1) IC5.4(IP-_2) J6.5 J6.6
NetIC6_1: IC6.1(IP+_1) IC6.2(IP+_2) U4.25(V)
NetIC6_3: IC6.3(IP-_1) IC6.4(IP-_2) J6.3 J6.4
NetIC7_3: IC7.3(IP-_1) IC7.4(IP-_2) J6.1 J6.2
NetR11_2: R11.2 R12.1 U4.21(NU) U4.22(NV) U4.23(NW)
NetR15_1: R15.1 U4.7(VTS)

### Library data of the parts
C28 = UPW1E220MDD: as C17 on sheet Boost_Stage; Datasheet Link: http://nichicon-us.com/english/products/pdfs/e-upw.pdf; Height: 12.5mm; Manufacturer_Part_Number: UPW1E220MDD; Mouser Part Number: 647-UPW1E220MDD; Mouser Price/Stock: https://www.mouser.com/Search/Refine.aspx?Keyword=647-UPW1E220MDD; RS Part Number: 7152625P; RS Price/Stock: http://uk.rs-online.com/web/p/products/7152625P; Allied Price/Stock: https://www.alliedelec.com/nichicon-upw1e220mdd/70187288/
C29 = C330C105K5R5TA: Capacitor 50V; Manufacturer_Name: Kemet; Datasheet Link: http://uk.rs-online.com/web/p/products/8704038; Height: 9mm; Manufacturer_Part_Number: C330C105K5R5TA; Mouser Part Number: 80-C330C105K5R; Mouser Price/Stock: https://www.mouser.com/Search/Refine.aspx?Keyword=80-C330C105K5R; RS Part Number: 8704038; RS Price/Stock: http://uk.rs-online.com/web/p/products/8704038
C30 C35 C39 C41 C49 = K104K10X7RF5UH5: Capacitor 50V; Manufacturer_Name: Vishay; Datasheet Link: https://www.vishay.com/docs/45171/kseries.pdf; Height: 6.2mm; Manufacturer_Part_Number: K104K10X7RF5UH5; Mouser Part Number: 594-K104K10X7RF5UH5; Mouser Price/Stock: https://www.mouser.com/Search/Refine.aspx?Keyword=594-K104K10X7RF5UH5
C31 C48 C50 = C315C103K5R5TA7990: Capacitor 50V; Manufacturer_Name: Kemet; Datasheet Link: https://api.kemet.com/component-edge/download/datasheet/C315C103K5R5TA.pdf; Height: 4.66mm; Manufacturer_Part_Number: C315C103K5R5TA7990; Mouser Part Number: N/A; Mouser Price/Stock: https://www.mouser.com/Search/Refine.aspx?Keyword=N%2FA
C32 C36 C45 = C0603C104K5RAC3121: Capacitor 50V; Manufacturer_Name: Kemet; Datasheet Link: https://mouser.componentsearchengine.com/Datasheets/1/C0603C104K5RAC3121.pdf; Height: 0.95mm; Manufacturer_Part_Number: C0603C104K5RAC3121; Mouser Part Number: 80-C603C104K5RAC3121; Mouser Price/Stock: https://www.mouser.com/Search/Refine.aspx?Keyword=80-C603C104K5RAC3121
C33 C37 C46 = CMP-2006-02924-1: Manufacturer: Murata; Part Number: GRM188R71H472KA01D
C34 C38 = UPW1J6R8MDD6: Capacitor Polarised; Manufacturer_Name: Nichicon; Allied_Number: 70187297; Datasheet Link: http://nichicon-us.com/english/products/pdfs/e-upw.pdf; Height: 12.5mm; Manufacturer_Part_Number: UPW1J6R8MDD6; RS Part Number: 8515424; RS Price/Stock: https://uk.rs-online.com/web/p/products/8515424; Allied Price/Stock: https://www.alliedelec.com/nichicon-upw1j6r8mdd6/70187297/
C40 = UPW1J6R8MDD6: Manufacturer_Name: Nichicon; Allied_Number: 70187297; Datasheet Link: http://nichicon-us.com/english/products/pdfs/e-upw.pdf; Height: 12.5mm; Manufacturer_Part_Number: UPW1J6R8MDD6; RS Part Number: 8515424; RS Price/Stock: https://uk.rs-online.com/web/p/products/8515424; Allied Price/Stock: https://www.alliedelec.com/nichicon-upw1j6r8mdd6/70187297/
C42 = GRM188R72A104MA35D: Capacitor; Manufacturer_Name: Murata Electronics; Height: 0.9mm; Manufacturer_Part_Number: GRM188R72A104MA35D; Mouser Part Number: 81-GRM188R72A104MA5D; Mouser Price/Stock: https://www.mouser.com/Search/Refine.aspx?Keyword=81-GRM188R72A104MA5D
C43 = RDER72A105K2M1H03A: as C10 on sheet Boost_Stage; Datasheet Link: https://psearch.en.murata.com/capacitor/product/RDER72A105K2M1H03A.html; Height: 5.5mm; Manufacturer_Part_Number: RDER72A105K2M1H03A; Mouser Part Number: 81-RDER72A105K2M1H3A; Mouser Price/Stock: https://www.mouser.com/Search/Refine.aspx?Keyword=81-RDER72A105K2M1H3A; RS Part Number: 1504005; RS Price/Stock: http://uk.rs-online.com/web/p/products/1504005
C44 = EEU-FS2A470: Capacitor Polarised; Manufacturer_Name: Panasonic; Datasheet Link: https://componentsearchengine.com/Datasheets/1/EEU-FS2A470.pdf; Height: 16.5mm; Manufacturer_Part_Number: EEU-FS2A470; Mouser Part Number: 667-EEU-FS2A470; Mouser Price/Stock: https://www.mouser.com/Search/Refine.aspx?Keyword=667-EEU-FS2A470
C47 = CMP-2007-00148-1: GRM2195C2A102JA01D; Manufacturer: Murata; Part Number: GRM2195C2A102JA01D
D8-D10 = P6KE91A-E3_54: as D3 on sheet Boost_Stage; Datasheet Link: https://www.mouser.com/datasheet/2/427/p6ke-1767850.pdf
D11 = BZX584C3V3-G3-08: Diode; Manufacturer_Name: Vishay; Datasheet Link: https://componentsearchengine.com/Datasheets/1/BZX584C3V3-G3-08.pdf; Height: 0.75mm; Manufacturer_Part_Number: BZX584C3V3-G3-08; Mouser Part Number: 78-BZX584C3V3-G3-08; Mouser Price/Stock: https://www.mouser.com/Search/Refine.aspx?Keyword=78-BZX584C3V3-G3-08
H14 H15 = 5003: as H3 on sheet Boost_Stage; Datasheet Link: https://componentsearchengine.com/Datasheets/1/5003.pdf; Height: 4.57mm; Manufacturer_Part_Number: 5003; Mouser Part Number: 534-5003; Mouser Price/Stock: https://www.mouser.com/Search/Refine.aspx?Keyword=534-5003; Allied Price/Stock: https://www.alliedelec.com/keystoneelectronics-5003/70799414/
IC5-IC7 = ACS725LLCTR-20AB-T: Integrated Circuit; Manufacturer_Name: Allegro Microsystems; Datasheet Link: https://www.allegromicro.com/~/media/Files/Datasheets/ACS725-Datasheet.ashx; Height: 1.75mm; Manufacturer_Part_Number: ACS725LLCTR-20AB-T
J6 = 1730515: Connector; Manufacturer_Name: Phoenix Contact; Allied_Number: 71065041; Datasheet Link: https://media.digikey.com/PDF/Data%20Sheets/Phoenix%20Contact%20PDFs/1730515.pdf; Height: 18mm; Manufacturer_Part_Number: 1730515; Mouser Part Number: 651-1730515; Mouser Price/Stock: https://www.mouser.com/Search/Refine.aspx?Keyword=651-1730515; Allied Price/Stock: https://www.alliedelec.com/phoenixcontact-1730515/71065041/
R11 R13-R15 = Res1: Resistor; Published: 8-Jun-2000; LatestRevisionDate: 17-Jul-2002; LatestRevisionNote: Re-released for DXP Platform.; PackageReference: AXIAL-0.3; Publisher: Altium Limited; PackageDescription: Axial Device, Thru-Hole; 2 Leads; 0.3 in Pin Spacing
R12 = WSHP2818R0500FEA: Resistor; Manufacturer_Name: Vishay; Datasheet Link: https://www.vishay.com/docs/30347/wshp2818.pdf; Height: 1.75mm; Manufacturer_Part_Number: WSHP2818R0500FEA; Mouser Part Number: 71-WSHP2818R0500FEA; Mouser Price/Stock: https://www.mouser.com/Search/Refine.aspx?Keyword=71-WSHP2818R0500FEA

## Nets that join several sheets
GND: Boost_Stage (25 pins), ee453_pcb_Schulz (16 pins), Power_Stage (17 pins), Drive_Module (24 pins)
3.3V: Boost_Stage (C9.1 IC4.5), ee453_pcb_Schulz (12 pins), Power_Stage (H12.1 PS1.6), Drive_Module (7 pins)
15V: Boost_Stage (5 pins), Power_Stage (H13.1 PS2.6), Drive_Module (8 pins)
24ADC: ee453_pcb_Schulz (U1.67), Power_Stage (5 pins)
24V: Boost_Stage (IC4.3 R2.1), Power_Stage (13 pins)
48ADC: Boost_Stage (5 pins), ee453_pcb_Schulz (U1.68)
48V: Boost_Stage (12 pins), Drive_Module (C42.1 C43.1 C44.1 U4.27)
AADC: ee453_pcb_Schulz (U1.69), Drive_Module (IC7.7)
AHIGH: ee453_pcb_Schulz (U1.76), Drive_Module (U4.9)
ALOW: ee453_pcb_Schulz (U1.75), Drive_Module (U4.3)
BADC: ee453_pcb_Schulz (U1.23), Drive_Module (IC6.7)
BHIGH: ee453_pcb_Schulz (U1.36), Drive_Module (U4.13)
BLOW: ee453_pcb_Schulz (U1.35), Drive_Module (U4.4)
CADC: ee453_pcb_Schulz (U1.63), Drive_Module (IC5.7)
CHIGH: ee453_pcb_Schulz (U1.78), Drive_Module (U4.17)
CLOW: ee453_pcb_Schulz (U1.77), Drive_Module (U4.5)
EPWM: Boost_Stage (H6.1 J4.1), ee453_pcb_Schulz (U1.80)
FAULT: ee453_pcb_Schulz (U1.64), Drive_Module (C48.1 R14.1)
IADC: Boost_Stage (C8.1 H3.1 R3.2), ee453_pcb_Schulz (U1.66)
SD: Boost_Stage (H7.1 J4.2), ee453_pcb_Schulz (U1.51)
VTS: ee453_pcb_Schulz (U1.40), Drive_Module (C50.1 D11.1 R15.2)